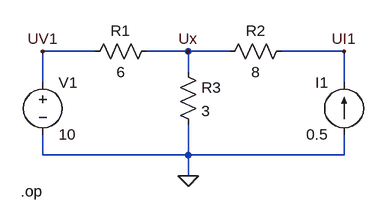
[diagram p0: schematic network.asc]
network.asc, the LTspice schematic file:
Version 4
SHEET 1 880 680
WIRE 64 48 -16 48
WIRE 208 48 144 48
WIRE 272 48 208 48
WIRE 448 48 352 48
WIRE 208 80 208 48
WIRE -16 96 -16 48
WIRE 448 96 448 48
WIRE -16 208 -16 176
WIRE 208 208 208 160
WIRE 208 208 -16 208
WIRE 448 208 448 176
WIRE 448 208 208 208
WIRE 208 240 208 208
FLAG 208 240 0
FLAG 208 48 Ux
FLAG 448 48 UI1
FLAG -16 48 UV1
SYMBOL voltage -16 80 R0
WINDOW 123 0 0 Left 2
WINDOW 39 0 0 Left 2
SYMATTR InstName V1
SYMATTR Value 10
SYMBOL res 160 32 R90
WINDOW 0 0 56 VBottom 2
WINDOW 3 32 56 VTop 2
SYMATTR InstName R1
SYMATTR Value 6
SYMBOL res 368 32 R90
WINDOW 0 0 56 VBottom 2
WINDOW 3 32 56 VTop 2
SYMATTR InstName R2
SYMATTR Value 8
SYMBOL current 448 176 R180
WINDOW 0 24 80 Left 2
WINDOW 3 24 0 Left 2
WINDOW 123 0 0 Left 2
WINDOW 39 0 0 Left 2
SYMATTR InstName I1
SYMATTR Value 0.5
SYMBOL res 192 64 R0
SYMATTR InstName R3
SYMATTR Value 3
TEXT -50 264 Left 2 !.op

The netlist it stands for:
* network.asc
V1 UV1 0 10
R1 Ux UV1 6
R2 UI1 Ux 8
I1 0 UI1 0.5
R3 Ux 0 3
.op
.backanno
.end

* Results of the author's LTspice run, read from the files saved beside the schematic
* Operating Point:
*   V(uv1) = 10 V
*   V(ux) = 4.333 V
*   V(ui1) = 8.333 V
*   I(I1) = 500 mA
*   I(R3) = 1.444 A
*   I(R2) = 500 mA
*   I(R1) = -944.4 mA
*   I(V1) = -944.4 mA